# EAGLE design C5_Running_indicators (EAGLE 9.2.2)
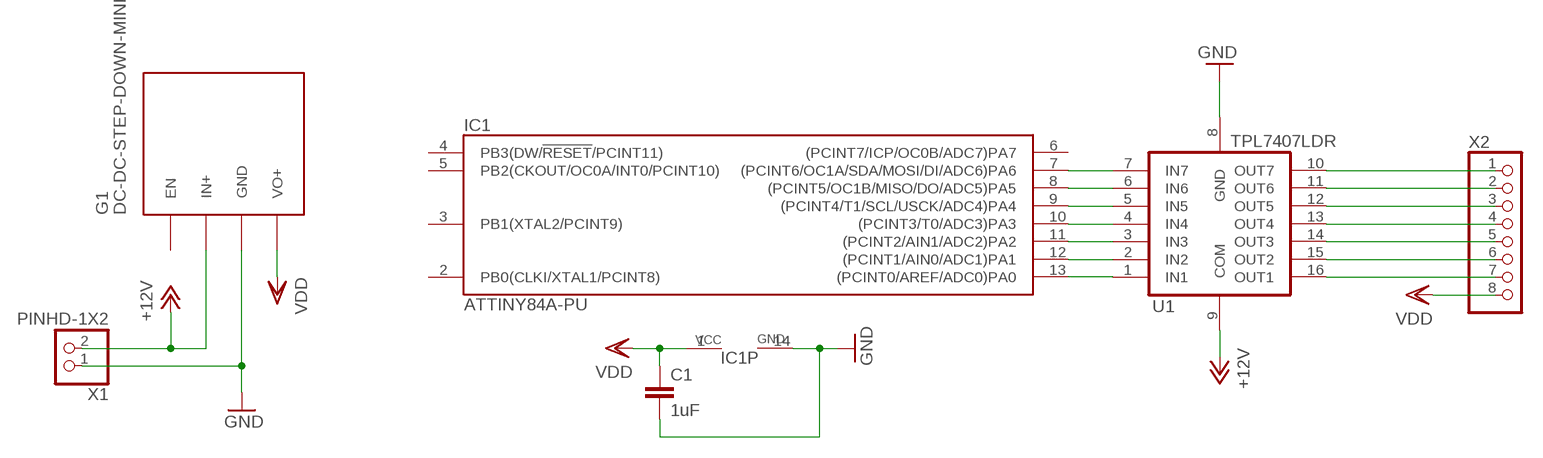
[diagram p0: schematic, sheet 1]

## Parts
C1  1uF  C-EU050-025X075  [C050-025X075]
G1  DC-DC-STEP-DOWN-MINI  [DC-DC-DOWN-MINI]
IC1  ATTINY84A-PU  [DIL14]
U1  TPL7407LDR  [SOIC16N]
X1  PINHD-1X2  [1X02]
X2  PINHD-1X8  [1X08]

## Nets
+12V: G1.2(IN+) U1.9(COM) X1.2
GND: C1.2 G1.3(GND) IC1.14(GND) U1.8(GND) X1.1
N$1: IC1.13((PCINT0/AREF/ADC0)PA0) U1.1(IN1)
N$2: IC1.12((PCINT1/AIN0/ADC1)PA1) U1.2(IN2)
N$3: IC1.11((PCINT2/AIN1/ADC2)PA2) U1.3(IN3)
N$4: IC1.10((PCINT3/T0/ADC3)PA3) U1.4(IN4)
N$5: IC1.9((PCINT4/T1/SCL/USCK/ADC4)PA4) U1.5(IN5)
N$6: IC1.8((PCINT5/OC1B/MISO/DO/ADC5)PA5) U1.6(IN6)
N$7: IC1.7((PCINT6/OC1A/SDA/MOSI/DI/ADC6)PA6) U1.7(IN7)
N$8: U1.10(OUT7) X2.1
N$9: U1.11(OUT6) X2.2
N$10: U1.12(OUT5) X2.3
N$11: U1.13(OUT4) X2.4
N$12: U1.14(OUT3) X2.5
N$13: U1.15(OUT2) X2.6
N$14: U1.16(OUT1) X2.7
VDD: C1.1 G1.4(VO+) IC1.1(VCC) X2.8
Unconnected: G1.1(EN) IC1.2(PB0(CLKI/XTAL1/PCINT8)) IC1.3(PB1(XTAL2/PCINT9)) IC1.4(PB3(DW/!RESET!/PCINT11)) IC1.5(PB2(CKOUT/OC0A/INT0/PCINT10)) IC1.6((PCINT7/ICP/OC0B/ADC7)PA7)

## Library data of the parts
C1 = resistor:C-EU: CAPACITOR, European symbol
G1 = Voltage:DC-DC-STEP-DOWN-MINI: Mini DC-DC 12-24V To 5V 3A Step Down Power Supply Module Voltage Buck Converter Adjustable Efficiency 97.5% Product Introduction: 1.Input Voltage:DC 4.5-24V 2.Output Voltage:integration adjustable and fixed output,back side can choose fiexd output voltage 3.Adjustable Range:0.8-17V,fixed voltage (1.8V 2.5V 3.3V 5V 9V 12V) 4.Output Current:3A (max),actual testing input 12V output 1.5A 5.Transform Efficiency:97.5%(max) (6.5 to 5V 0.7A) 6.Switch Frequency:500KHz 7.Output Ripple Wave:20mV (12V to 5V 3A) 20m band width 8.Operating Voltage:-40 Celsius-85 Celsius 9.Output Overvoltage Protection:no 10.Static Current:0.85MA 11.Load Adjust Rate:±1% 12.Voltage Adjust Rate:±0.5% 13.Dynamic Response Speed:5% 200uS 14.Output Short Circuit Protection:yes 15.Input Transposition Protection:no 16.Enable Control:yes 17.Connecting Type:soldering 18.Input Way:soldering 19.Output Way:soldering/pin 20.Soldering Hole Space:2.54mm
IC1 = atmel:ATTINY*4: 8-bit AVR tiny Microcontroller Status obsolete/discontinued aktiv aktiv aktiv ATtiny24(V) ATtiny44(V) ATtiny84(V) ATtiny24A ATtiny44A ATtiny84A General purpose working registers 32 SRAM 128 B 256 B 512 B 128 B 256 B 512 B Program flash memory 2 kB 4 kB 8 kB 2 kB 4 kB 8 kB EEPROM 128 B 256 B 512 B 128 B 256 B 512 B 16-bit Timer/Counter 1 8-bit Timer/Counter 1 USART 1 ADC channels 8 ADC resolution 10 bit AC 1 Watchdog 1 General purpose I/O 12 External interrupts 12 Operating voltage 1.8 ... 5.5 V for ATtiny#4V 1.8 ... 5.5 V 2.7 ... 5.5 V for ATtiny#4 Speed grade 0 ... 4 MHz @ 1.8 ... 5.5 V for ATtiny#4V 0 ... 4 MHz @ 1.8 ... 5.5 V 0 ... 10 MHz @ 2.7 ... 5.5 V for ATtiny#4V 0 ... 10 MHz @ 2.7 ... 5.5 V 0 ... 10 MHz @ 2.7 ... 5.5 V for ATtiny#4 0 ... 20 MHz @ 4.5 ... 5.5 V 0 ... 20 MHz @ 4.5 ... 5.5 V for ATtiny#4 Clock options calibrated internal 8 MHz oscillator external crystal oscillator / ceramic resonator external 32.768 kHz low-frequency crystal oscillator internal 128 kHz oscillator external clock input
U1 = transistor-fet:TPL7407L: The library has been designed by Richard Magdycz <https://www.facebook.com/groups/eaglecadsoftUK>
X1 = Headery:PINHD-1X2
X2 = Headery:PINHD-1X8: PIN HEADER

## Board
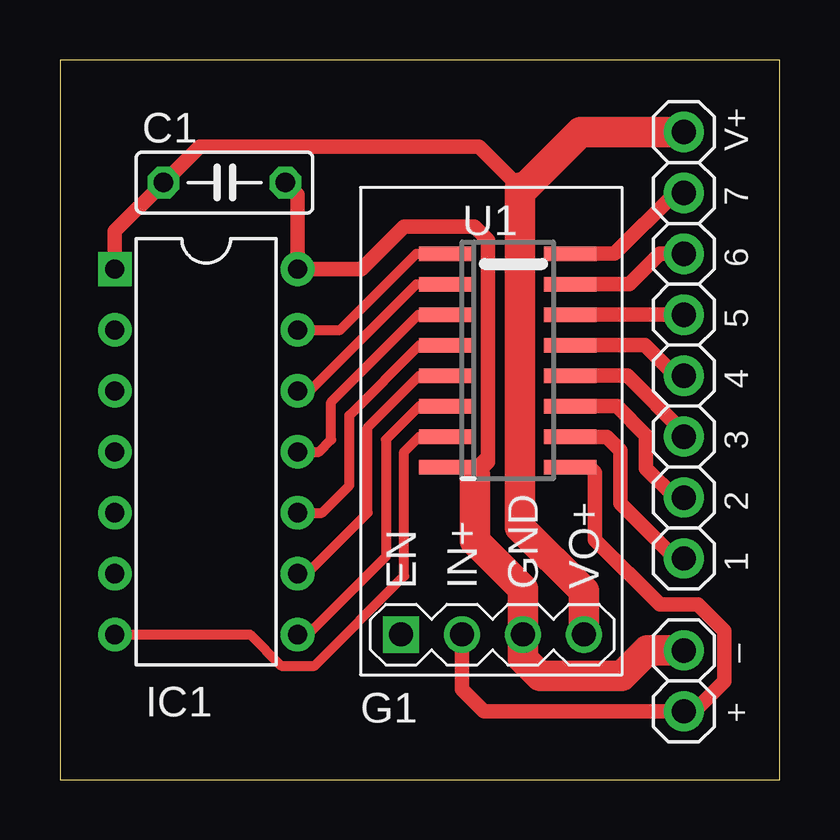
[diagram p1: board, top side]

Size 30 x 30 mm. Coordinates in mm from the lower left corner, seen from the top.
Outline: 0,0 30,0 30,30 0,30 0,0
Copper layers (1*16): Top 0.035mm / dielectric 1.5mm / Bottom 0.035mm
Design rules "default *": minimum track width 6mil, minimum drill 0.35mm, track to track 10mil, track to pad 10mil, pad to pad 10mil, via to via 10mil, smd to smd 10mil, copper to edge 40mil, drill to drill 6mil, minimum pad ring 10mil, minimum via ring 8mil, stop-mask expansion 4mil, vias tented up to drill 0mil, thermal gap 10mil

### Footprints (pad centres in the part's own frame; a part is rotated, then mirrored left to right if it is on the bottom)
C050-025X075 = drill 0.813 octagon: 1 -2.54,0; 2 2.54,0
DC-DC-DOWN-MINI = drill 1 square: 1 -5.08,3.81 | drill 1: 2 -5.08,1.27; 3 -5.08,-1.27; 4 -5.08,-3.81
DIL14 = drill 0.8 pad 1.4 square: 1 -7.62,-3.81 | drill 0.8 pad 1.4: 2 -5.08,-3.81; 3 -2.54,-3.81; 4 0,-3.81; 5 2.54,-3.81; 6 5.08,-3.81; 7 7.62,-3.81; 8 7.62,3.81; 9 5.08,3.81; 10 2.54,3.81; 11 0,3.81; 12 -2.54,3.81; 13 -5.08,3.81; 14 -7.62,3.81
SOIC16N = smd 0.6 x 2.2: 1 -4.445,-2.6; 2 -3.175,-2.6; 3 -1.905,-2.6; 4 -0.635,-2.6; 5 0.635,-2.6; 6 1.905,-2.6; 7 3.175,-2.6; 8 4.445,-2.6; 9 4.445,2.6; 10 3.175,2.6; 11 1.905,2.6; 12 0.635,2.6; 13 -0.635,2.6; 14 -1.905,2.6; 15 -3.175,2.6; 16 -4.445,2.6
1X02 = drill 1.016 pad 1.676: 1 -1.27,0; 2 1.27,0
1X08 = drill 1.016 pad 1.676: 1 -6.35,0; 2 -3.81,0; 3 -1.27,0; 4 1.27,0; 5 3.81,0; 6 6.35,0; 7 8.89,0; 8 11.43,0

### Placement (x,y rotation side)
C1  6.86,24.89 0 top
G1  18.03,11.12 90 top
IC1  6.1,13.66 270 top
U1  18.67,17.47 270 top
X1  26.01,4.11 270 top
X2  26.01,15.57 90 top

### Tracks (layer width: path | path; a pad name or v marks a point on that pad's centre or on a via)
+12V
  Top 0.61: G1.2 16.76,3.76 17.68,2.84 X1.2 26.44,2.84 27.7,4.1 27.7,6.2 26.6,7.3 25,7.3 22.3,10 22.3,12.8 22.07,13.03 U1.9
GND
  Top 0.61: C1.2 9.91,24.38 IC1.14 12.57,21.28 14.35,23.06 17.29,23.06 17.85,22.5 17.85,13.45 | U1.8 17.43,13.03 17.85,13.45 | 17.85,13.45 17.85,13.25 17.3,12.7
  Top 1.27: X1.1 24.49,5.38 23.42,4.32 20.02,4.32 19.3,5.03 G1.3 19.3,7.95 17.3,9.95 17.3,12.7
N$1
  Top 0.406: IC1.13 11.68,18.74 14.86,21.92 U1.1
N$2
  Top 0.406: IC1.12 10.41,16.2 14.86,20.65 U1.2
N$3
  Top 0.406: IC1.11 10.79,13.66 11.3,14.17 11.3,15.74 14.94,19.38 U1.3
N$4
  Top 0.406: IC1.10 10.92,11.12 12.06,12.27 12.06,15.19 14.99,18.11 U1.4
N$5
  Top 0.406: IC1.9 10.29,8.58 12.83,11.12 12.83,14.68 14.99,16.84 U1.5
N$6
  Top 0.406: IC1.8 10.34,6.04 13.59,9.29 13.59,14.17 14.99,15.57 U1.6
N$7
  Top 0.406: U1.7 14.99,14.3 14.35,13.66 14.35,8.48 10.62,4.75 9.22,4.75 7.92,6.04 IC1.7
N$8
  Top 0.61: X2.1 25.65,9.22 23.37,11.5 23.37,13.71 22.79,14.29 21.28,14.29 U1.10
N$9
  Top 0.61: U1.11 23.22,15.57 24.43,14.35 24.43,12.98 25.65,11.76 X2.2
N$10
  Top 0.61: U1.12 23.65,16.84 26.01,14.47 X2.3
N$11
  Top 0.61: U1.13 24.38,18.11 25.65,16.84 X2.4
N$12
  Top 0.61: X2.5 U1.14
N$13
  Top 0.61: X2.6 25.02,21.92 23.75,20.65 U1.15
N$14
  Top 0.61: U1.16 23.11,21.92 25.65,24.46 X2.7
VDD
  Top 0.61: IC1.1 2.29,22.86 C1.1 5.82,26.39 17.48,26.39 19.18,24.68 19.28,24.58
  Top 1.27: G1.4 21.84,7.86 19.18,10.52 19.18,24.68 | X2.8 21.7,27 19.28,24.58

### Text on the board
tPlace: V+ | 7 | 6 | 5 | 4 | 3 | 2 | 1 | – | +